# Altium project LEDMATRIX.PrjPcb
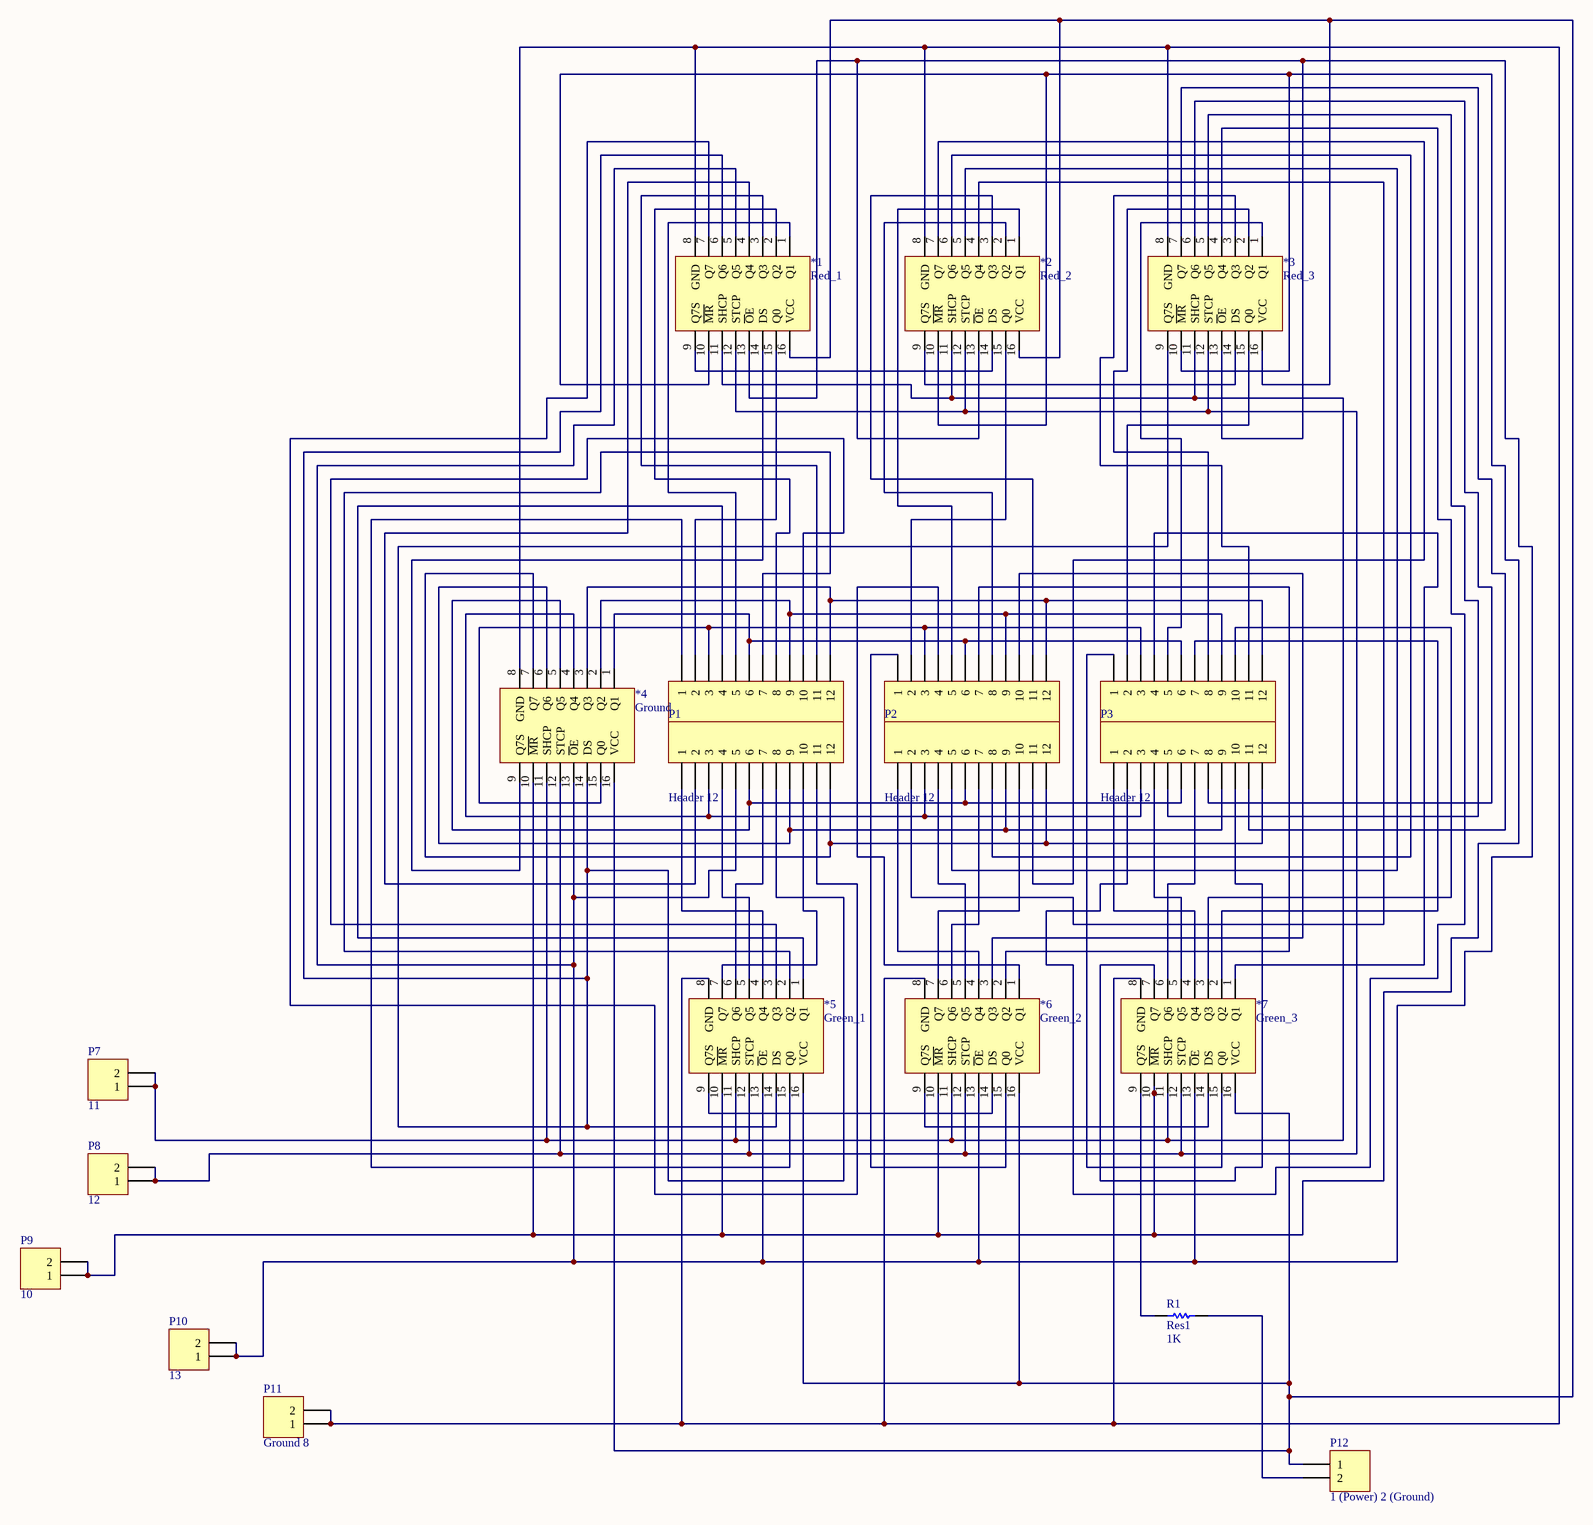
[diagram p0: Senior design LED matrix 3.0.SchDoc]
1 sheet, 20 parts. Net scope: global (net labels, ports and power ports of the same name join across sheets).
Board file: Senior design LED matrix 3.0.PcbDoc

## Sheet Senior design LED matrix 3.0.SchDoc
size C

### Parts
*1  Red_1  [DIP-16]
*2  Red_2  [DIP-16]
*3  Red_3  [DIP-16]
*4  Ground  [DIP-16]
*5  Green_1  [DIP-16]
*6  Green_2  [DIP-16]
*7  Green_3  [DIP-16]
P1  Header 12  [HDR1X12]
P2  Header 12  [HDR1X12]
P3  Header 12  [HDR1X12]
P4  Header 12  [HDR1X12]
P5  Header 12  [HDR1X12]
P6  Header 12  [HDR1X12]
P7  11  [HDR1X2]
P8  12  [HDR1X2]
P9  10  [HDR1X2]
P10  13  [HDR1X2]
P11  Ground 8  [HDR1X2]
P12  1 (Power) 2 (Ground)  [HDR1X2]
R1  Res1  value 1K  [AXIAL-0.3]

### Nets
Net*1_1: *1.1(Q1) P4.5
Net*1_2: *1.2(Q2) P4.8
Net*1_3: *1.3(Q3) P4.11
Net*1_4: *1.4(Q4) P1.2
Net*1_5: *1.5(Q5) *1.13(~{O}E) *2.13(~{O}E) *3.13(~{O}E) *4.13(~{O}E) *5.13(~{O}E) *6.13(~{O}E) *7.13(~{O}E) P1.5 P10.1 P10.2
Net*1_6: *1.6(Q6) *3.9(Q7S) *4.14(DS) *5.14(DS) P1.8
Net*1_7: *1.7(Q7) P1.11
Net*1_8: *1.8(GND) *2.8(GND) *3.8(GND) *4.8(GND) *5.8(GND) *6.8(GND) *7.8(GND) P11.1 P11.2
Net*1_9: *1.9(Q7S) *2.14(DS)
Net*1_10: *1.10(~{MR}) *2.10(~{MR}) *3.10(~{MR}) *4.10(~{MR}) *5.10(~{MR}) *6.10(~{MR}) *7.10(~{MR}) P9.1 P9.2
Net*1_11: *1.11(SHCP) *2.11(SHCP) *3.11(SHCP) *4.11(SHCP) *5.11(SHCP) *6.11(SHCP) *7.11(SHCP) P7.1 P7.2
Net*1_12: *1.12(STCP) *2.12(STCP) *3.12(STCP) *4.12(STCP) *5.12(STCP) *6.12(STCP) *7.12(STCP) P8.1 P8.2
Net*1_14: *1.14(DS) *4.9(Q7S)
Net*1_15: *1.15(Q0) P4.2
Net*1_16: *1.16(VCC) *2.16(VCC) *3.16(VCC) *4.16(VCC) *5.16(VCC) *6.16(VCC) *7.16(VCC) P12.1
Net*2_1: *2.1(Q1) P5.5
Net*2_2: *2.2(Q2) P5.8
Net*2_3: *2.3(Q3) P5.11
Net*2_4: *2.4(Q4) P2.2
Net*2_5: *2.5(Q5) P2.5
Net*2_6: *2.6(Q6) P2.8
Net*2_7: *2.7(Q7) P2.11
Net*2_9: *2.9(Q7S) *3.14(DS)
Net*2_15: *2.15(Q0) P5.2
Net*3_1: *3.1(Q1) P6.5
Net*3_2: *3.2(Q2) P6.8
Net*3_3: *3.3(Q3) P6.11
Net*3_4: *3.4(Q4) P3.2
Net*3_5: *3.5(Q5) P3.5
Net*3_6: *3.6(Q6) P3.8
Net*3_7: *3.7(Q7) P3.11
Net*3_15: *3.15(Q0) P6.2
Net*4_1: *4.1(Q1) P4.6 P5.6 P6.6
Net*4_2: *4.2(Q2) P4.9 P5.9 P6.9
Net*4_3: *4.3(Q3) P4.12 P5.12 P6.12
Net*4_4: *4.4(Q4) P1.3 P2.3 P3.3
Net*4_5: *4.5(Q5) P1.6 P2.6 P3.6
Net*4_6: *4.6(Q6) P1.9 P2.9 P3.9
Net*4_7: *4.7(Q7) P1.12 P2.12 P3.12
Net*4_15: *4.15(Q0) P4.3 P5.3 P6.3
Net*5_1: *5.1(Q1) P4.4
Net*5_2: *5.2(Q2) P4.7
Net*5_3: *5.3(Q3) P4.10
Net*5_4: *5.4(Q4) P1.1
Net*5_5: *5.5(Q5) P1.4
Net*5_6: *5.6(Q6) P1.7
Net*5_7: *5.7(Q7) P1.10
Net*5_9: *5.9(Q7S) *6.14(DS)
Net*5_15: *5.15(Q0) P4.1
Net*6_1: *6.1(Q1) P5.4
Net*6_2: *6.2(Q2) P5.7
Net*6_3: *6.3(Q3) P5.10
Net*6_4: *6.4(Q4) P2.1
Net*6_5: *6.5(Q5) P2.4
Net*6_6: *6.6(Q6) P2.7
Net*6_7: *6.7(Q7) P2.10
Net*6_9: *6.9(Q7S) *7.14(DS)
Net*6_15: *6.15(Q0) P5.1
Net*7_1: *7.1(Q1) P6.4
Net*7_2: *7.2(Q2) P6.7
Net*7_3: *7.3(Q3) P6.10
Net*7_4: *7.4(Q4) P3.1
Net*7_5: *7.5(Q5) P3.4
Net*7_6: *7.6(Q6) P3.7
Net*7_7: *7.7(Q7) P3.10
Net*7_9: *7.9(Q7S) R1.1
Net*7_15: *7.15(Q0) P6.1
NetP12_2: P12.2 R1.2

### Library data of the parts
*1-*7 = Component_1
P1-P6 = Header 12: Header, 12-Pin; LatestRevisionDate: 17-Jul-2002; LatestRevisionNote: Re-released for DXP Platform.; Publisher: Altium Limited
P7-P12 = Header 2: Header, 2-Pin; LatestRevisionDate: 17-Jul-2002; LatestRevisionNote: Re-released for DXP Platform.; Publisher: Altium Limited
R1 = Res1: Resistor; Published: 8-Jun-2000; LatestRevisionDate: 17-Jul-2002; LatestRevisionNote: Re-released for DXP Platform.; PackageReference: AXIAL-0.3; Publisher: Altium Limited; PackageDescription: Axial Device, Thru-Hole; 2 Leads; 0.3 in Pin Spacing